# Altium project RelayTritonAIGB.PrjPcb
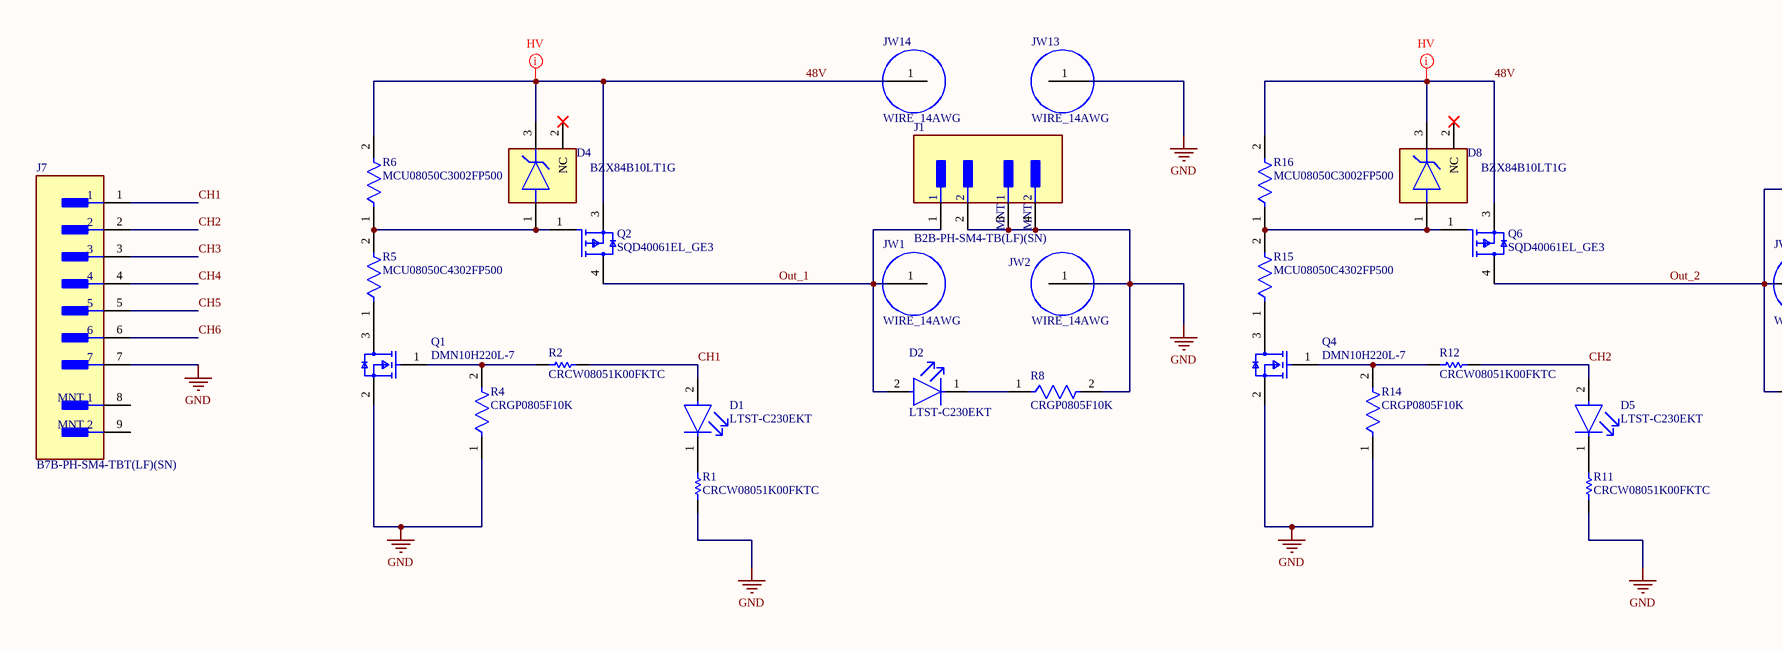
[diagram p0: RelaySchematic.SchDoc, left]
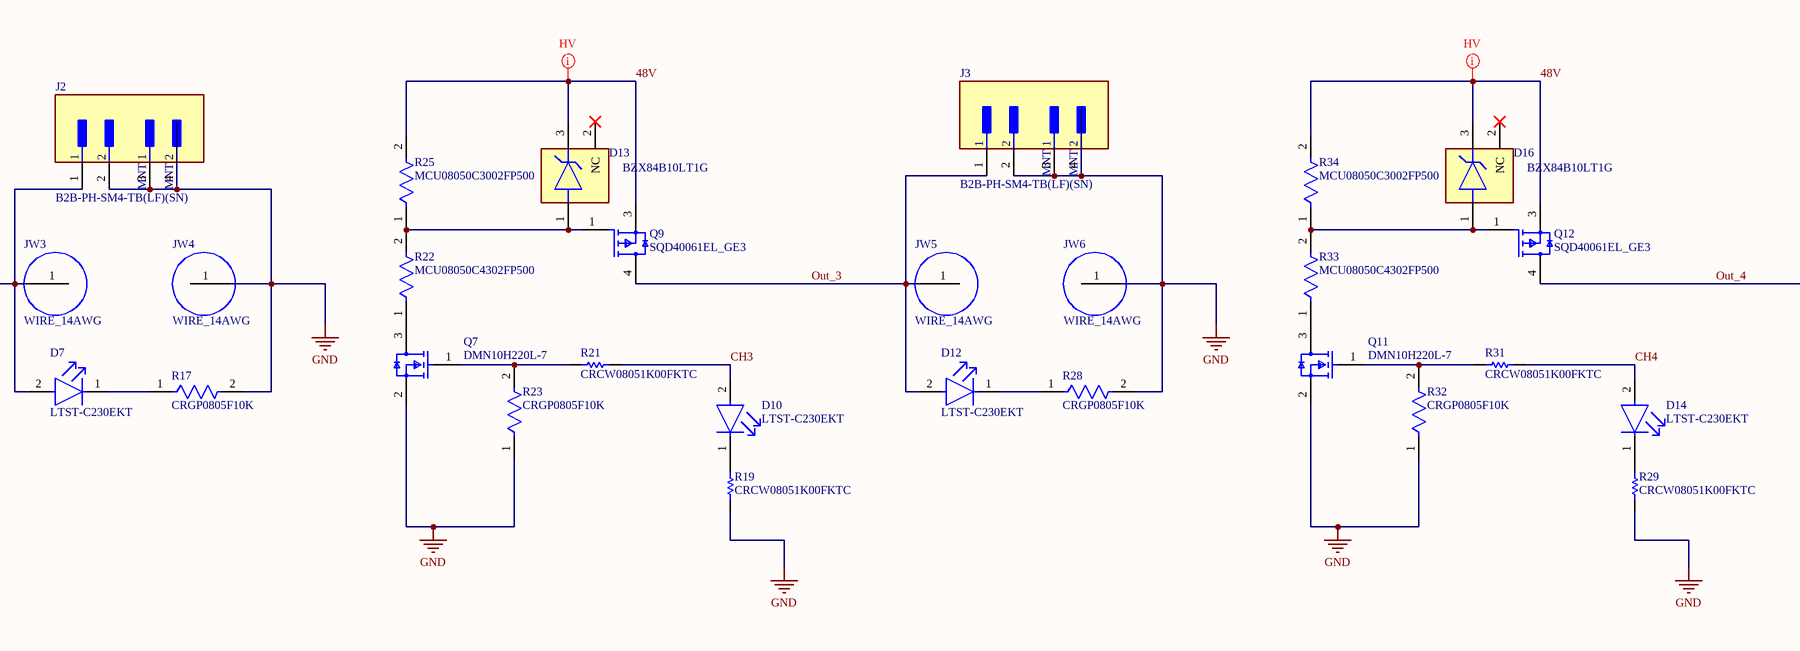
[diagram p1: RelaySchematic.SchDoc, middle]
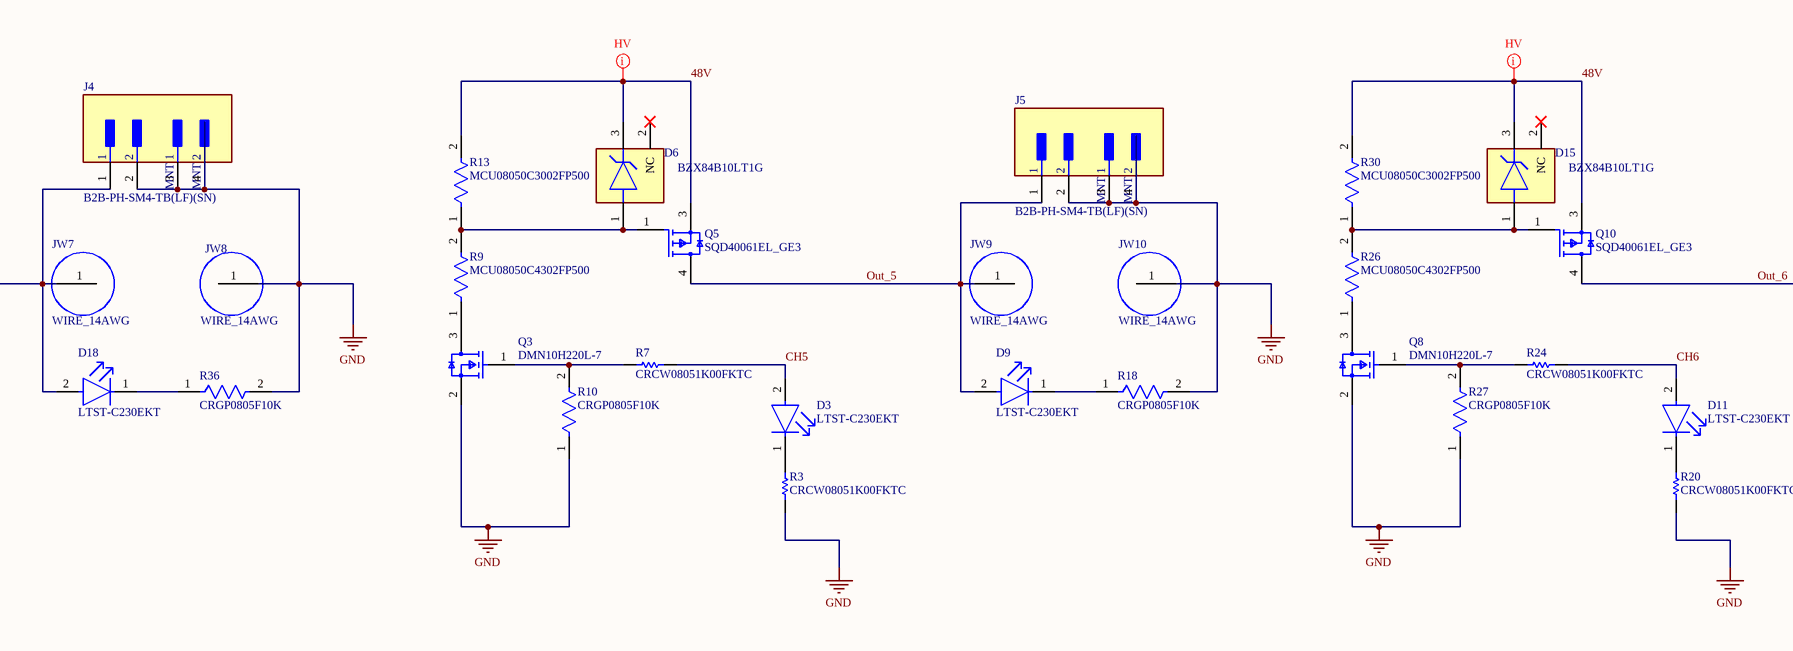
[diagram p2: RelaySchematic.SchDoc, right]
1 sheet, 87 parts. Net scope: global (net labels, ports and power ports of the same name join across sheets).
Board file: RelayPCB.PcbDoc

## Sheet RelaySchematic.SchDoc
size A; SheetNumber: 1; SheetTotal: 1

### Parts
D1  LTST-C230EKT  [FP-LTST-C230EKT-MFG]
D2  LTST-C230EKT  [FP-LTST-C230EKT-MFG]
D3  LTST-C230EKT  [FP-LTST-C230EKT-MFG]
D4  BZX84B10LT1G  [FP-318-MFG]
D5  LTST-C230EKT  [FP-LTST-C230EKT-MFG]
D6  BZX84B10LT1G  [FP-318-MFG]
D7  LTST-C230EKT  [FP-LTST-C230EKT-MFG]
D8  BZX84B10LT1G  [FP-318-MFG]
D9  LTST-C230EKT  [FP-LTST-C230EKT-MFG]
D10  LTST-C230EKT  [FP-LTST-C230EKT-MFG]
D11  LTST-C230EKT  [FP-LTST-C230EKT-MFG]
D12  LTST-C230EKT  [FP-LTST-C230EKT-MFG]
D13  BZX84B10LT1G  [FP-318-MFG]
D14  LTST-C230EKT  [FP-LTST-C230EKT-MFG]
D15  BZX84B10LT1G  [FP-318-MFG]
D16  BZX84B10LT1G  [FP-318-MFG]
D17  LTST-C230EKT  [FP-LTST-C230EKT-MFG]
D18  LTST-C230EKT  [FP-LTST-C230EKT-MFG]
J1  B2B-PH-SM4-TB(LF)(SN)  [FP-B2B-PH-SM4-TB_LF_SN-MFG]
J2  B2B-PH-SM4-TB(LF)(SN)  [FP-B2B-PH-SM4-TB_LF_SN-MFG]
J3  B2B-PH-SM4-TB(LF)(SN)  [FP-B2B-PH-SM4-TB_LF_SN-MFG]
J4  B2B-PH-SM4-TB(LF)(SN)  [FP-B2B-PH-SM4-TB_LF_SN-MFG]
J5  B2B-PH-SM4-TB(LF)(SN)  [FP-B2B-PH-SM4-TB_LF_SN-MFG]
J6  B2B-PH-SM4-TB(LF)(SN)  [FP-B2B-PH-SM4-TB_LF_SN-MFG]
J7  B7B-PH-SM4-TBT(LF)(SN)  [FP-B7B-PH-SM4-TBT_LF_SN-MFG]
JW1  WIRE_14AWG  [WIRE_14AWG_PTH]
JW2  WIRE_14AWG  [WIRE_14AWG_PTH]
JW3  WIRE_14AWG  [WIRE_14AWG_PTH]
JW4  WIRE_14AWG  [WIRE_14AWG_PTH]
JW5  WIRE_14AWG  [WIRE_14AWG_PTH]
JW6  WIRE_14AWG  [WIRE_14AWG_PTH]
JW7  WIRE_14AWG  [WIRE_14AWG_PTH]
JW8  WIRE_14AWG  [WIRE_14AWG_PTH]
JW9  WIRE_14AWG  [WIRE_14AWG_PTH]
JW10  WIRE_14AWG  [WIRE_14AWG_PTH]
JW11  WIRE_14AWG  [WIRE_14AWG_PTH]
JW12  WIRE_14AWG  [WIRE_14AWG_PTH]
JW13  WIRE_14AWG  [WIRE_14AWG_PTH]
JW14  WIRE_14AWG  [WIRE_14AWG_PTH]
Q1  DMN10H220L-7  [FP-SOT23-MFG]
Q2  SQD40061EL_GE3  [FP-T13-0592-MFG]
Q3  DMN10H220L-7  [FP-SOT23-MFG]
Q4  DMN10H220L-7  [FP-SOT23-MFG]
Q5  SQD40061EL_GE3  [FP-T13-0592-MFG]
Q6  SQD40061EL_GE3  [FP-T13-0592-MFG]
Q7  DMN10H220L-7  [FP-SOT23-MFG]
Q8  DMN10H220L-7  [FP-SOT23-MFG]
Q9  SQD40061EL_GE3  [FP-T13-0592-MFG]
Q10  SQD40061EL_GE3  [FP-T13-0592-MFG]
Q11  DMN10H220L-7  [FP-SOT23-MFG]
Q12  SQD40061EL_GE3  [FP-T13-0592-MFG]
R1  CRCW08051K00FKTC  [RESC2013X50X30ML20T20]
R2  CRCW08051K00FKTC  [RESC2013X50X30ML20T20]
R3  CRCW08051K00FKTC  [RESC2013X50X30ML20T20]
R4  CRGP0805F10K  [FP-CRGP0805-IPC_C]
R5  MCU08050C4302FP500  [FP-MCU0805-IPC_C]
R6  MCU08050C3002FP500  [FP-MCU0805-MFG]
R7  CRCW08051K00FKTC  [RESC2013X50X30ML20T20]
R8  CRGP0805F10K  [FP-CRGP0805-IPC_C]
R9  MCU08050C4302FP500  [FP-MCU0805-IPC_C]
R10  CRGP0805F10K  [FP-CRGP0805-IPC_C]
R11  CRCW08051K00FKTC  [RESC2013X50X30ML20T20]
R12  CRCW08051K00FKTC  [RESC2013X50X30ML20T20]
R13  MCU08050C3002FP500  [FP-MCU0805-MFG]
R14  CRGP0805F10K  [FP-CRGP0805-IPC_C]
R15  MCU08050C4302FP500  [FP-MCU0805-IPC_C]
R16  MCU08050C3002FP500  [FP-MCU0805-MFG]
R17  CRGP0805F10K  [FP-CRGP0805-IPC_C]
R18  CRGP0805F10K  [FP-CRGP0805-IPC_C]
R19  CRCW08051K00FKTC  [RESC2013X50X30ML20T20]
R20  CRCW08051K00FKTC  [RESC2013X50X30ML20T20]
R21  CRCW08051K00FKTC  [RESC2013X50X30ML20T20]
R22  MCU08050C4302FP500  [FP-MCU0805-IPC_C]
R23  CRGP0805F10K  [FP-CRGP0805-IPC_C]
R24  CRCW08051K00FKTC  [RESC2013X50X30ML20T20]
R25  MCU08050C3002FP500  [FP-MCU0805-MFG]
R26  MCU08050C4302FP500  [FP-MCU0805-IPC_C]
R27  CRGP0805F10K  [FP-CRGP0805-IPC_C]
R28  CRGP0805F10K  [FP-CRGP0805-IPC_C]
R29  CRCW08051K00FKTC  [RESC2013X50X30ML20T20]
R30  MCU08050C3002FP500  [FP-MCU0805-MFG]
R31  CRCW08051K00FKTC  [RESC2013X50X30ML20T20]
R32  CRGP0805F10K  [FP-CRGP0805-IPC_C]
R33  MCU08050C4302FP500  [FP-MCU0805-IPC_C]
R34  MCU08050C3002FP500  [FP-MCU0805-MFG]
R35  CRGP0805F10K  [FP-CRGP0805-IPC_C]
R36  CRGP0805F10K  [FP-CRGP0805-IPC_C]

### Nets
GND: J1.2 J1.3(MNT_1) J1.4(MNT_2) J2.2 J2.3(MNT_1) J2.4(MNT_2) J3.2 J3.3(MNT_1) J3.4(MNT_2) J4.2 J4.3(MNT_1) J4.4(MNT_2) J5.2 J5.3(MNT_1) J5.4(MNT_2) J6.2 J6.3(MNT_1) J6.4(MNT_2) J7.7 JW2.1 JW4.1 JW6.1 JW8.1 JW10.1 JW12.1 JW13.1 Q1.2(S) Q3.2(S) Q4.2(S) Q7.2(S) Q8.2(S) Q11.2(S) R1.1 R3.1 R4.1 R8.2 R10.1 R11.1 R14.1 R17.2 R18.2 R19.1 R20.1 R23.1 R27.1 R28.2 R29.1 R32.1 R35.2 R36.2
48V: D4.3(C) D6.3(C) D8.3(C) D13.3(C) D15.3(C) D16.3(C) JW14.1 Q2.3(S) Q5.3(S) Q6.3(S) Q9.3(S) Q10.3(S) Q12.3(S) R6.2 R13.2 R16.2 R25.2 R30.2 R34.2
CH1: D1.2(A) J7.1 R2.2
CH2: D5.2(A) J7.2 R12.2
CH3: D10.2(A) J7.3 R21.2
CH4: D14.2(A) J7.4 R31.2
CH5: D3.2(A) J7.5 R7.2
CH6: D11.2(A) J7.6 R24.2
Out_1: D2.2(A) J1.1 JW1.1 Q2.4(D)
Out_2: D7.2(A) J2.1 JW3.1 Q6.4(D)
Out_3: D12.2(A) J3.1 JW5.1 Q9.4(D)
Out_4: D18.2(A) J4.1 JW7.1 Q12.4(D)
Out_5: D9.2(A) J5.1 JW9.1 Q5.4(D)
Out_6: D17.2(A) J6.1 JW11.1 Q10.4(D)
NetD1_1: D1.1(C) R1.2
NetD2_1: D2.1(C) R8.1
NetD3_1: D3.1(C) R3.2
NetD4_1: D4.1(A) Q2.1(G) R5.2 R6.1
NetD5_1: D5.1(C) R11.2
NetD6_1: D6.1(A) Q5.1(G) R9.2 R13.1
NetD7_1: D7.1(C) R17.1
NetD8_1: D8.1(A) Q6.1(G) R15.2 R16.1
NetD9_1: D9.1(C) R18.1
NetD10_1: D10.1(C) R19.2
NetD11_1: D11.1(C) R20.2
NetD12_1: D12.1(C) R28.1
NetD13_1: D13.1(A) Q9.1(G) R22.2 R25.1
NetD14_1: D14.1(C) R29.2
NetD15_1: D15.1(A) Q10.1(G) R26.2 R30.1
NetD16_1: D16.1(A) Q12.1(G) R33.2 R34.1
NetD17_1: D17.1(C) R35.1
NetD18_1: D18.1(C) R36.1
NetQ1_1: Q1.1(G) R2.1 R4.2
NetQ1_3: Q1.3(D) R5.1
NetQ3_1: Q3.1(G) R7.1 R10.2
NetQ3_3: Q3.3(D) R9.1
NetQ4_1: Q4.1(G) R12.1 R14.2
NetQ4_3: Q4.3(D) R15.1
NetQ7_1: Q7.1(G) R21.1 R23.2
NetQ7_3: Q7.3(D) R22.1
NetQ8_1: Q8.1(G) R24.1 R27.2
NetQ8_3: Q8.3(D) R26.1
NetQ11_1: Q11.1(G) R31.1 R32.2
NetQ11_3: Q11.3(D) R33.1

Not connected (* = marked no-connect by the designer): D4 2(NC)*; D6 2(NC)*; D8 2(NC)*; D13 2(NC)*; D15 2(NC)*; D16 2(NC)*; J7 8(MNT_1) 9(MNT_2)

### Layout directives
CompClassName: HV: 48V

### Library data of the parts
D1-D3 D5 D7 D9-D12 D14 D17 D18 = CMP-22017-000030-1: LED RED CLEAR CHIP SMD; Forward Current: 30mA; Test Current: 10mA; Number of Elements: 1; Viewing Angle: 130°; Dominant Wavelength: 621nm; Forward Voltage: 2V; Lens Style: Diffused; Power Rating: 100mW; Reverse Voltage: 5V; Wavelength: 630nm; Luminous Intensity: 6mcd; Lens Color: Colorless; Case/Package: 1206; Case Code (Imperial): 1206; Package Quantity: 1; Lead Free: Lead Free; Case Code (Metric): 3216; Height: 1.1mm; Lens Transparency: Clear; Mount: Surface Mount; Depth: 1.6mm; Number of LEDs: 1; Power Dissipation: 100mW; Max Operating Temperature: 85°C; Width: 1.6mm; Color: Red; Number of Pins: 2; Min Operating Temperature: -55°C; Packaging: Tape and Reel; Radiation Hardening: No; Illumination Color: Red; Length: 3.2mm
D4 D6 D8 D13 D15 D16 = CMP-00278-47358401-1: BZX84B10LT1G Diode Zener Single 10V 225mW 3-Pin SOT-23 T/R - Tape and Reel; Manufacturer Lifecycle Status: ACTIVE; Impedance: 15Ω; Tolerance: 2%; Max Power Dissipation: 250mW; Reverse Voltage: 7V; Test Current: 5mA; ESD Protection: Yes; Max Junction Temperature (Tj): 150°C; Max Reverse Leakage Current: 200nA; Case/Package: TO-236-3; Max Operating Temperature: 150°C; NexarPartId: 47358401; Mount: Surface Mount; Min Operating Temperature: -65°C; Packaging: Tape & Reel (TR); Contact Plating: Tin; RoHS: Compliant; Zener Voltage: 10V; Height: 1.11mm; Power Dissipation: 250mW; Lifecycle Status: Production; Schedule B: 8541100050; Lead Free: Lead Free; Number of Pins: 3; Element Configuration: Single
J1-J6 = CMP-2000-05163-2: CONN HEADER SMD 2POS 2MM; Number of Poles: 2; Max Current Rating: 2A; Gender: Male; Working Voltage: 100V; Mated Stacking Heights: 8.6mm; Contact Resistance: 20mR; Insulation Resistance: 1GR; Number of Contacts: 2; Housing Material: Polyamide; Lead Pitch: 2mm; Packaging: Tape and Reel; Fastening Type: Detent; Contact Finish - Mating: TIN; Width: 5.5mm; Min Operating Temperature: -25°C; Mount: Surface Mount; Current Rating: 2A; Pitch: 2mm; REACH SVHC: No SVHC; Flammability Rating: UL94 V-0; Contact Plating: Tin; Voltage Rating (AC): 100V; Length: 7.95mm; Number of Rows: 1; Max Operating Temperature: 85°C; Connector Type: Header; Height: 9.4mm; Insulation Material: Nylon; Depth: 5mm; Color: White; Termination: Solder; Housing Color: Beige; Contact Mating Length: 0.13inch; Contact Material: Copper Alloy; Orientation: Straight; Contact Type: Male Pin; Lead Free: Lead Free; Voltage Rating: 100V; Series: PH; Number of Positions: 2; Contact Shape: Square; Max Voltage Rating (AC): 100V; Insulation Color: Natural
J7 = CMP-17439-000653-1: CONN HEADER SMD 7POS 2MM; Number of Positions: 7; Mount: Surface Mount; Lead Free: Lead Free; Termination: Crimp; Pitch: 2mm
Q1 Q3 Q4 Q7 Q8 Q11 = CMP-12801-000027-1: MOSFET N-CH 100V 1.6A SOT-23; Manufacturer: Diodes Inc.; Typ Forward Diode Voltage: 0.7V; Max Junction Temp: +150°C; Reverse Recovery Charge: 9.8nC; Gate Charge At Vgs: 8.3nC @ 10V; Turn Off Delay Time: 7.9ns; Depletion Mode: False; Power Dissipation: 1.3W; Rthja Max: 177°C/W; Reverse Recovery Time: 17ns; Gate To Source Voltage: 16V; Drain To Source Resistance: 250mΩ; Threshold Vgs Max: 2.5V; Turn On Delay Time: 6.8ns; Threshold Vgs Min: 1V; Pulse Drain Current: 8A; Number Of Channels: 1; Max Forward Diode Voltage: 1.2V; Standoff Height: 0.013mm; Input Capacitace At Vds: 401pF @ 25V; Continuous Drain Current: 1.4A; Manufacturer Part Number: DMN10H220L-7; Device Class L2: Transistors; Automotive: No; Device Class L3: MOSFETs; Drain To Source Breakdown Voltage: 100V; Footprint Url: https://www.diodes.com/assets/Package-Files/SOT23.pdf; Package: SOT23; Lead Free: Yes; Temperature: -55°C to +150°C; Drain To Source Voltage: 100V; Device Class L1: Discrete Semiconductors; ComponentLink2URL: https://www.diodes.com/assets/Datasheets/DMN10H220L.pdf; Temperature Range High: +150°C; Temperature Range Low: -55°C; Category: Trans; Mouser Description: DMN10H220L Series 100 V 250 mOhm N-Channel Enhancement Mode Mosfet - SOT-23; RoHS: TRUE; ComponentLink2Description: Datasheet; Height: 1.1mm; Digikey Description: MOSFET N-CH 100V 1.6A SOT-23; Octopart: https://octopart.com/dmn10h220l-7-diodes+inc.-38898610; Number Of N Channels: 1
Q2 Q5 Q6 Q9 Q10 Q12 = CMP-02550-000284-1: MOSFET P-CH 40V 100A TO252AA
R1-R3 R7 R11 R12 R19-R21 R24 R29 R31 = CMP-2001-04268-1: Manufacturer: Vishay Dale; Part Number: CRCW08051K00FKTC
R4 R8 R10 R14 R17 R18 R23 R27 R28 R32 R35 R36 = CMP-03211-006861-1: CRGP 0805 10K 1%; Manufacturer: TE; Power Rating: 0.33W; Description: CRGP0805 10KΩ 0.33W ±100ppm/°C 1% 150V; Voltage Rating: 150V; Value: 10KΩ; Tolerance: 0.01; Temperature Coefficient: ±100ppm/°C; Manufacturer Part Number: CRGP0805F10K; ComponentLink2URL: https://www.mouser.com/datasheet/2/418/NG_DS_9-1773463-9_A-1358566.pdf; Temperature Range Low: -55°C; Ipc Land Pattern Name: RESC200125X55; Device Class L2: Resistors; Automotive: No; Device Class L3: Chip SMD Resistors; Composition: Thick Film; Temperature Range High: +155°C; Temperature: -55°C to +155°C; Height: 0.65mm; Series: CRGP; RoHS: TRUE; Device Class L1: Passive Components; Octopart: https://octopart.com/crgp0805f10k-te+connectivity-91018782; Package: CRGP0805; Digikey Description: CRGP 0805 10K 1%; Ambient Temperature Range High: +70°C; Lead Free: Yes; ComponentLink2Description: Datasheet; Category: Res; Resistance: 10KΩ
R5 R9 R15 R22 R26 R33 = CMP-02407-010835-1: RES 1.05K OHM 0.5% 1/5W 0805; Tolerance: 1%; Resistance: 43000R; Height: 450um; Lead Free: Lead Free; Length: 2mm; Case/Package: 0805; Width: 1.25mm
R6 R13 R16 R25 R30 R34 = CMP-02407-001702-1: RES 1.05K OHM 0.5% 1/5W 0805; Temperature Coefficient: 50ppm/°C; Tolerance: 1%; Resistance: 30kR; Case/Package: 0805; Composition: Thin Film; Height: 450um; Width: 1.25mm; Max Operating Temperature: 125°C; Lead Free: Lead Free; Radiation Hardening: No; Min Operating Temperature: -55°C; Contact Plating: Tin; Length: 2mm